# Altium project J2534 Adapter.PrjPcb
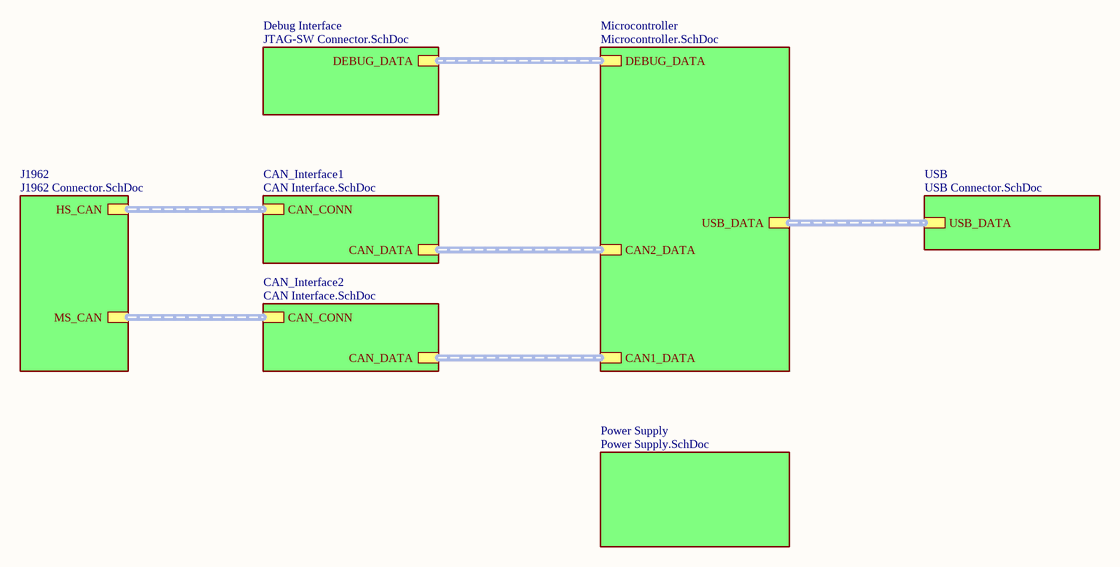
[diagram p0: Adapter_Func.SchDoc]
7 sheets, 55 parts. Net scope: hierarchical (ports join the sheet entries above them; power ports are global).
Board file: Main_Board.PcbDoc
Sheets:
  Adapter_Func.SchDoc
    Microcontroller = Microcontroller.SchDoc
    CAN_Interface1 = CAN Interface.SchDoc
    USB = USB Connector.SchDoc
    J1962 = J1962 Connector.SchDoc
    Power Supply = Power Supply.SchDoc
    Debug Interface = JTAG-SW Connector.SchDoc
    CAN_Interface2 = CAN Interface.SchDoc

## Sheet Adapter_Func.SchDoc
size A4; SheetNumber: 1; SheetTotal: 7

### Sub-sheets
CAN_Interface1 = CAN Interface.SchDoc: CAN_DATA (harness CAN_DATA), CAN_CONN (harness CAN_PHY)
CAN_Interface2 = CAN Interface.SchDoc: CAN_DATA (harness CAN_DATA), CAN_CONN (harness CAN_PHY)
Debug Interface = JTAG-SW Connector.SchDoc: DEBUG_DATA (harness JTAG_SWD)
J1962 = J1962 Connector.SchDoc: MS_CAN (harness CAN_PHY), HS_CAN (harness CAN_PHY)
Microcontroller = Microcontroller.SchDoc: DEBUG_DATA (harness JTAG_SWD), USB_DATA (harness USB_DATA), CAN2_DATA (harness CAN_DATA), CAN1_DATA (harness CAN_DATA)
Power Supply = Power Supply.SchDoc: no entries
USB = USB Connector.SchDoc: USB_DATA (harness USB_DATA)

### Buses and harness runs
harness sheet CAN_Interface1/CAN_CONN = sheet J1962/HS_CAN
harness sheet CAN_Interface1/CAN_DATA = sheet Microcontroller/CAN2_DATA
harness sheet CAN_Interface2/CAN_CONN = sheet J1962/MS_CAN
harness sheet CAN_Interface2/CAN_DATA = sheet Microcontroller/CAN1_DATA
harness sheet Debug Interface/DEBUG_DATA = sheet Microcontroller/DEBUG_DATA
harness sheet Microcontroller/USB_DATA = sheet USB/USB_DATA

## Sheet Microcontroller.SchDoc
size A4; SheetNumber: 7; SheetTotal: 7; SPICEModelCacheTAOBNIVI: <root> / <DocumentId>TAOBNIVI</DocumentId> / </root>
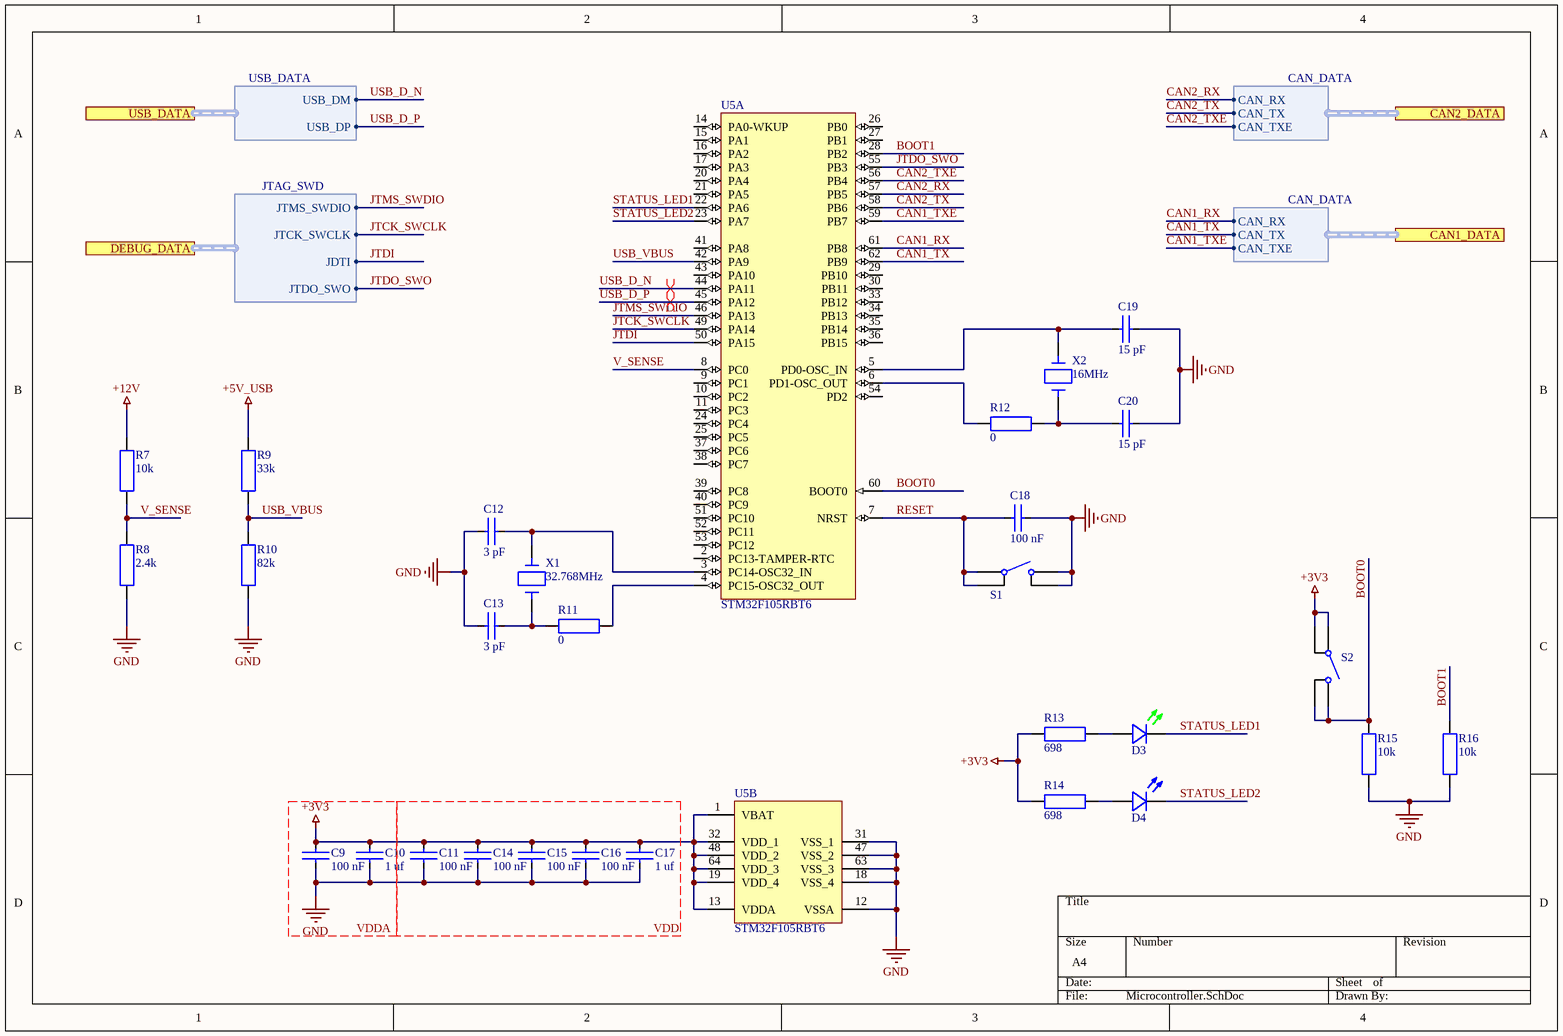
[diagram p1: Microcontroller.SchDoc]

### Parts
C9  100 nF  [0603 SMD CAP]
C10  1 uf  [0603 SMD CAP]
C11  100 nF  [0603 SMD CAP]
C12  3 pF  [0603 SMD CAP]
C13  3 pF  [0603 SMD CAP]
C14  100 nF  [0603 SMD CAP]
C15  100 nF  [0603 SMD CAP]
C16  100 nF  [0603 SMD CAP]
C17  1 uf  [0603 SMD CAP]
C18  100 nF  [0603 SMD CAP]
C19  15 pF  [0603 SMD CAP]
C20  15 pF  [0603 SMD CAP]
D3  LED Green 0603  [0603 SMD LED]  (value not drawn)
D4  LED Blue 0603  [0603 SMD LED]  (value not drawn)
R7  10k  [0603 SMD Res]
R8  2.4k  [0603 SMD Res]
R9  33k  [0603 SMD Res]
R10  82k  [0603 SMD Res]
R11  0  [0603 SMD Res]
R12  0  [0603 SMD Res]
R13  698  [0603 SMD Res]
R14  698  [0603 SMD Res]
R15  10k  [0603 SMD Res]
R16  10k  [0603 SMD Res]
S1  Tactile SPST Switch  [Tactile Switch 4.2x3.4]  (value not drawn)
S2  Tactile SPST Switch  [Tactile Switch 4.2x3.4]  (value not drawn)
U5  STM32F105RBT6  [STM-LQFP64_V]  (parts A,B of 2)
X1  32.768MHz  [3215 SMD CRYSTAL]
X2  16MHz  [3225 SMD Crystal]

### Ports
CAN1_DATA (harness CAN_DATA, see Adapter_Func[2B]), CAN2_DATA (harness CAN_DATA, see Adapter_Func[2B]), DEBUG_DATA (harness JTAG_SWD, see Adapter_Func[2A], JTAG-SW Connector[1B]), USB_DATA (harness USB_DATA, see Adapter_Func[3B], USB Connector[4B])

### Harnesses
CAN_DATA: CAN_RX, CAN_TX, CAN_TXE
USB_DATA: USB_DM, USB_DP
JTAG_SWD: JTMS_SWDIO, JTCK_SWCLK, JDTI, JTDO_SWO

### Nets
+3V3: C9.2 C10.2 C11.2 C14.2 C15.2 C16.2 C17.2 R13.2 R14.2 S2.1 S2.2 U5.1(VBAT) U5.13(VDDA) U5.19(VDD_4) U5.32(VDD_1) U5.48(VDD_2) U5.64(VDD_3)
+5V_USB: R9.2
+12V: R7.2
GND: C9.1 C10.1 C11.1 C12.1 C13.1 C14.1 C15.1 C16.1 C17.1 C18.2 C19.2 C20.2 R8.1 R10.1 R15.1 R16.1 S1.3 S1.4 U5.12(VSSA) U5.18(VSS_4) U5.31(VSS_1) U5.47(VSS_2) U5.63(VSS_3)
BOOT0: R15.2 S2.3 S2.4 U5.60(BOOT0)
BOOT1: R16.2 U5.28(PB2)
CAN1_RX: U5.61(PB8) ; port CAN1_DATA.CAN_RX
CAN1_TX: U5.62(PB9) ; port CAN1_DATA.CAN_TX
CAN1_TXE: U5.59(PB7) ; port CAN1_DATA.CAN_TXE
CAN2_RX: U5.57(PB5) ; port CAN2_DATA.CAN_RX
CAN2_TX: U5.58(PB6) ; port CAN2_DATA.CAN_TX
CAN2_TXE: U5.56(PB4) ; port CAN2_DATA.CAN_TXE
JTCK_SWCLK: U5.49(PA14) ; port DEBUG_DATA.JTCK_SWCLK
JTDI: U5.50(PA15) ; port DEBUG_DATA.JDTI
JTDO_SWO: U5.55(PB3) ; port DEBUG_DATA.JTDO_SWO
JTMS_SWDIO: U5.46(PA13) ; port DEBUG_DATA.JTMS_SWDIO
RESET: C18.1 S1.1 S1.2 U5.7(NRST)
STATUS_LED1: D3.2 U5.22(PA6)
STATUS_LED2: D4.2 U5.23(PA7)
USB_D_N: U5.44(PA11) ; port USB_DATA.USB_DM
USB_D_P: U5.45(PA12) ; port USB_DATA.USB_DP
USB_VBUS: R9.1 R10.2 U5.42(PA9)
V_SENSE: R7.1 R8.2 U5.8(PC0)
NetC12_2: C12.2 U5.3(PC14-OSC32_IN) X1.2
NetC13_2: C13.2 R11.2 X1.1
NetC19_1: C19.1 U5.5(PD0-OSC_IN) X2.3
NetC20_1: C20.1 R12.1 X2.1
NetD3_1: D3.1 R13.1
NetD4_1: D4.1 R14.1
NetR11_1: R11.1 U5.4(PC15-OSC32_OUT)
NetR12_2: R12.2 U5.6(PD1-OSC_OUT)

Not connected (* = marked no-connect by the designer): U5 2(PC13-TAMPER-RTC) 9(PC1) 10(PC2) 11(PC3) 14(PA0-WKUP) 15(PA1) 16(PA2) 17(PA3) 20(PA4) 21(PA5) 24(PC4) 25(PC5) 26(PB0) 27(PB1) 29(PB10) 30(PB11) 33(PB12) 34(PB13) 35(PB14) 36(PB15) 37(PC6) 38(PC7) 39(PC8) 40(PC9) 41(PA8) 43(PA10) 51(PC10) 52(PC11) 53(PC12) 54(PD2)

### Layout directives
differential pair: USB_D_N, USB_D_P

### Notes on the sheet
- VDDA
- VDD

### Library data of the parts
C9 C11 C14-C16 C18 = Cap 100nF 0603: 25V 100nF X7R ±10% 0603 Multilayer Ceramic Capacitors MLCC; Part Number: CL10B104KA8NNNC; ComponentLink1Description: LCSC; ComponentLink1URL: https://lcsc.com/product-detail/Multilayer-Ceramic-Capacitors-MLCC-SMD-SMT_Samsung-Electro-Mechanics-CL10B104KA8NNNC_C1590.html
C10 C17 = Cap 1u 0603: 25V 1uF X5R ±10% 0603 Multilayer Ceramic Capacitors MLCC; Part Number: CC0603KRX5R8BB105
C12 C13 = Cap 3pF 0603: 50V 3pF NP0 0.25pF 0603 Multilayer Ceramic Capacitors MLCC; Part Number: CC0603JRNPO9BN100
C19 C20 = Cap 15pF 0603: 50V 15pF NP0 ±5% 0603 Multilayer Ceramic Capacitors MLCC; Part Number: CC0603JRNPO9BN100
D3 = LED Green 0603: 20mA 518nm Colorless transparence -40℃~+85℃ 520nm~535nm Emerald 120° 110mW 0603; Part Number: 19-217/GHC-YR1S2/3T; ComponentLink1Description: Datasheet; ComponentLink1URL: https://datasheet.lcsc.com/lcsc/1811101510_Everlight-Elec-19-217-GHC-YR1S2-3T_C72043.pdf
D4 = LED Blue 0603: 25mA Green -30℃~+85℃ Positive post Blue 120° 80mW 0603; Part Number: XL-1608BGWC-06; ComponentLink1Description: Datasheet; ComponentLink1URL: https://datasheet.lcsc.com/lcsc/2211030000_XINGLIGHT-XL-1608BGWC-06_C965809.pdf
R7 R15 R16 = Resistor 10k 0603 1%: Part Number: RC0603FR-0710KL
R8 = Resistor 2.4k 0603 1%: 100mW Thick Film Resistors 75V ±100ppm/℃ ±1% -55℃~+155℃ 2.4kΩ 0603 Chip Resistor; Part Number: RC0603FR-072K4L
R9 = Resistor 33k 0603: 100mW Thin Film Resistor 75V ±25ppm/℃ ±1% -55℃~+155℃ 33kΩ 0603 Chip Resistor; Part Number: ARG03FTC3302; ComponentLink1Description: LCSC; ComponentLink1URL: https://lcsc.com/product-detail/Chip-Resistor-Surface-Mount_Viking-Tech-ARG03FTC3302_C217971.html
R10 = Resistor 82k 0603: 100mW Thick Film Resistors 50V ±100ppm/℃ ±1% -55℃~+155℃ 82kΩ 0603 Chip Resistor; Part Number: FRC0603F8202TS; ComponentLink1Description: LCSC; ComponentLink1URL: https://lcsc.com/product-detail/Chip-Resistor-Surface-Mount_FOJAN-FRC0603F8202TS_C2907072.html
R11 R12 = Resistor 0 0603: Thick Film Resistors -55℃~+155℃ 0Ω 0603 Chip Resistor; Part Number: FRC0603P000 TS; ComponentLink1Description: LCSC; ComponentLink1URL: https://lcsc.com/product-detail/Chip-Resistor-Surface-Mount_FOJAN-FRC0603P000-TS_C2907080.html
R13 R14 = Resistor 698 0603 1%: 100mW Thick Film Resistors 75V ±100ppm/℃ ±1% -55℃~+155℃ 698Ω 0603 Chip Resistor; Part Number: AC0603FR-07698RL; ComponentLink1Description: LCSC; ComponentLink1URL: https://lcsc.com/product-detail/Chip-Resistor-Surface-Mount_YAGEO-AC0603FR-07698RL_C144640.html
S1 S2 = Tactile SPST Switch: Part Number: YTSA016C0254004B; ComponentLink1Description: Datasheet; ComponentLink1URL: https://datasheet.lcsc.com/lcsc/2106061735_DGBZ-YTSA016C0254004B_C2764970.pdf
U5 = CMP-0237-00224-3: ARM Cortex-M3 32-bit MCU, 128 KB Flash, 64 KB Internal RAM, 51 I/Os, 64-pin LQFP, -40 to 85 degC, Tray; D/A Converter: 2x12-bit (2 Channel); Supply Voltage(Vcc) min (V): 2; A/D Converter: 2x12-bit (16 Channel); Internal RAM Size (kB): 64; Operating Frequency(F) (Processor speed) (MHz): 72; FLASH Size (Prog) (kB): 128; I/Os (High Current): 51; ComponentLink2Description: Datasheet; Core: ARM Cortex-M3; ComponentLink2URL: http://www.st.com/st-web-ui/static/active/en/resource/technical/document/datasheet/CD00220364.pdf; Mounting Technology: Surface Mount; PackageVersion: Rev. 4, 06/2013; PackageReference: LQFP64; PartNumber: STM32F105RBT6; ComponentLink3URL: http://www.st.com/st-web-ui/static/active/en/resource/technical/document/datasheet/DM00037051.pdf; DatasheetVersion: Rev. 6; PackageDescription: 64-Pin Low Profile Quad Flat Package, 10 x 10 mm Body, 0.5 mm Pitch; ComponentLink3Description: Package Specification; ComponentLink1Description: Manufacturer URL; ComponentLink1URL: http://www.st.com/web/en/home.html; Packing: Tray
X1 = Crystal 32.768MHz SMD: 32.768kHz 6pF 70kΩ ±20ppm -40℃~+85℃ SMD3215-2P Crystals ROHS; Part Number: NX3215SA-32.768K-STD-MUA-14; ComponentLink1Description: Datasheet; ComponentLink1URL: https://datasheet.lcsc.com/lcsc/1810171130_NDK-NX3215SA-32-768K-STD-MUA-14_C156244.pdf
X2 = Crystal 16MHz 3225: Crystal 16MHz 12pf; ComponentLink1Description: ChipDip; ComponentLink1URL: https://www.chipdip.ru/product0/8010531849

## Sheet CAN Interface.SchDoc
size A4; SheetNumber: 4; SheetTotal: 7
Used 2 times, as channels CAN_Interface1, CAN_Interface2. Parts and nets are listed once, with the designators drawn on the sheet.
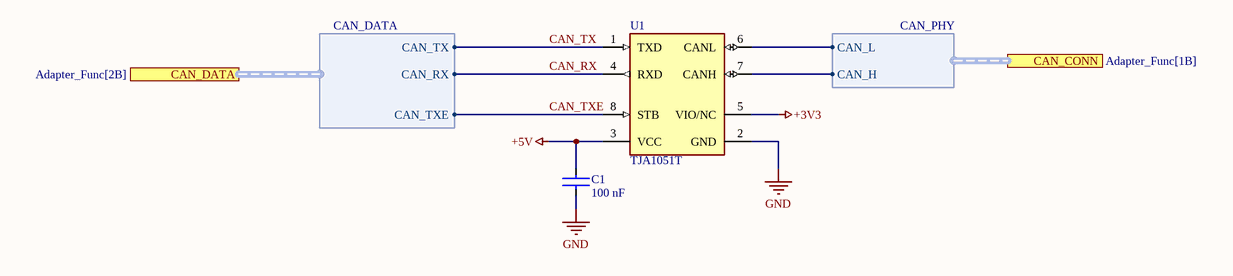
[diagram p2: CAN Interface.SchDoc]

### Parts
C1  100 nF  [0603 SMD CAP]
U1  TJA1051T  [SOIC-8]

### Ports
CAN_CONN (harness CAN_PHY, see Adapter_Func[1B]), CAN_DATA (harness CAN_DATA, see Adapter_Func[2B])

### Harnesses
CAN_DATA: CAN_TX, CAN_RX, CAN_TXE
CAN_PHY: CAN_L, CAN_H

### Nets
+3V3: U1.5(VIO/NC)
+5V: C1.2 U1.3(VCC)
GND: C1.1 U1.2(GND)
CAN_RX: U1.4(RXD) ; port CAN_DATA.CAN_RX
CAN_TX: U1.1(TXD) ; port CAN_DATA.CAN_TX
CAN_TXE: U1.8(STB) ; port CAN_DATA.CAN_TXE
NetU1_6: U1.6(CANL) ; port CAN_CONN.CAN_L
NetU1_7: U1.7(CANH) ; port CAN_CONN.CAN_H

### Channels
CAN_Interface1: designators end in A
CAN_Interface2: designators end in B

### Library data of the parts
C1 = Cap 100nF 0603: as C9 on sheet Microcontroller; ComponentLink1Description: LCSC; ComponentLink1URL: https://lcsc.com/product-detail/Multilayer-Ceramic-Capacitors-MLCC-SMD-SMT_Samsung-Electro-Mechanics-CL10B104KA8NNNC_C1590.html
U1 = CAN Transeiver TJA1051T: TJA1051T CAN Transeiver up to 5 Mbaud/s; Part Number: TJA1051T,118; ComponentLink1Description: Datasheet; ComponentLink1URL: https://datasheet.lcsc.com/lcsc/1809192316_NXP-Semicon-TJA1051T-118_C18387.pdf

## Sheet USB Connector.SchDoc
size A4; SheetNumber: 5; SheetTotal: 7
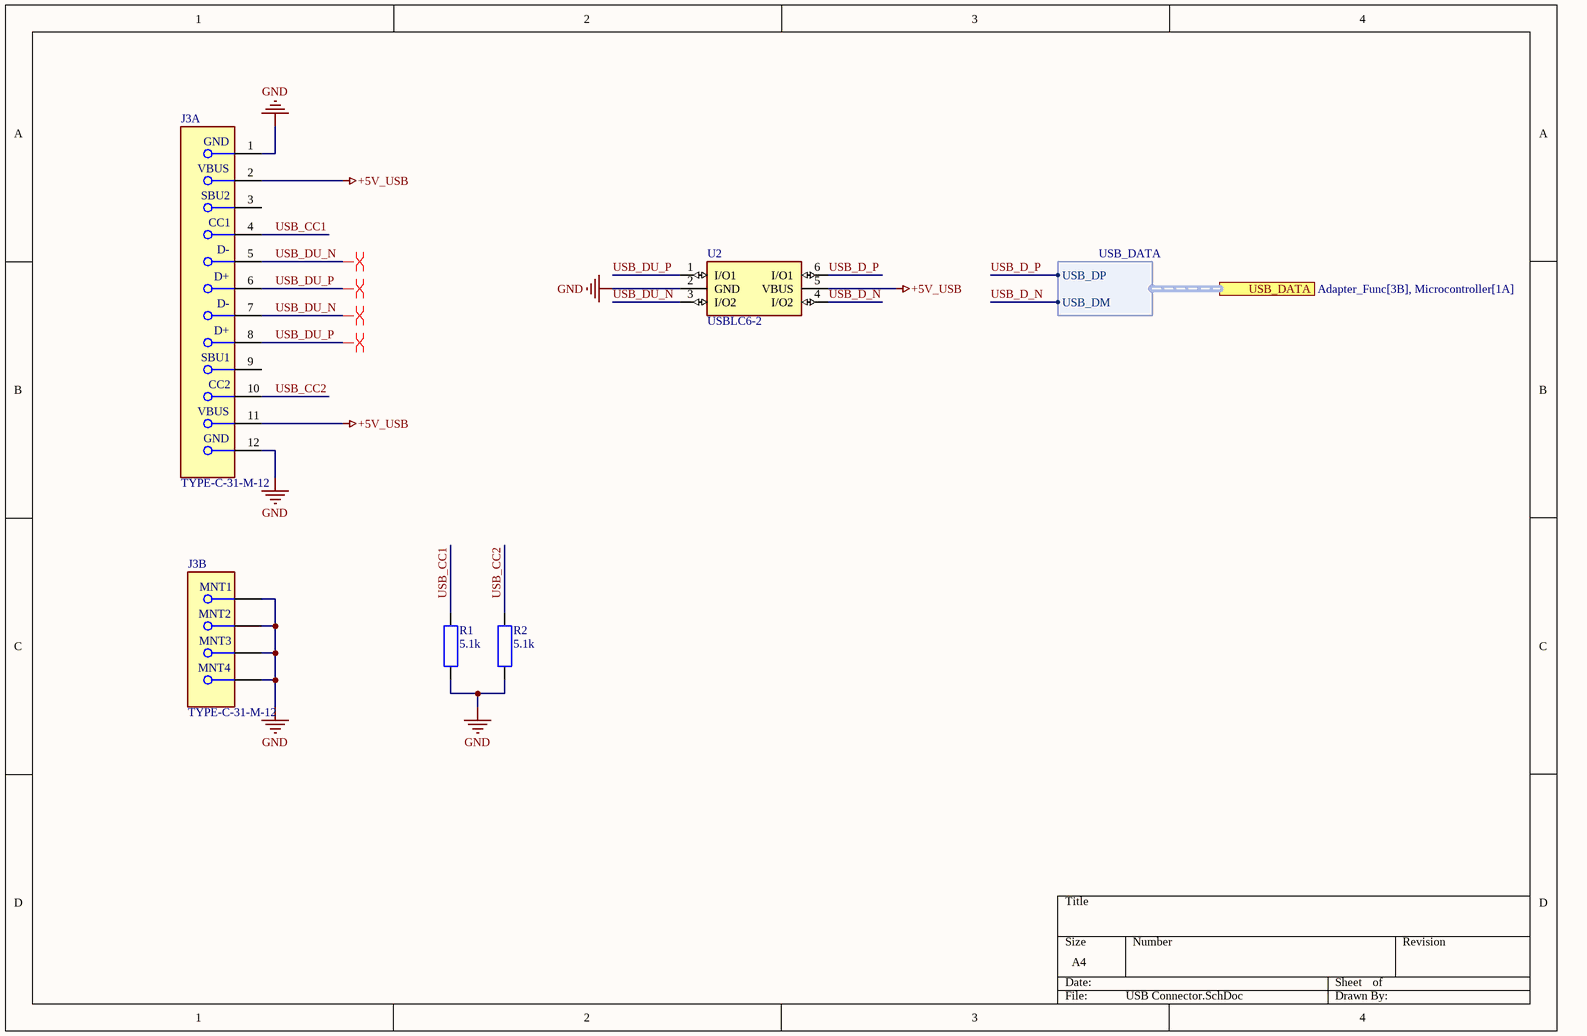
[diagram p3: USB Connector.SchDoc]

### Parts
J3  TYPE-C-31-M-12  [TYPE-C-31-M-12]  (parts A,B of 2)
R1  5.1k  [0603 SMD Res]
R2  5.1k  [0603 SMD Res]
U2  USBLC6-2  [SOT23-6L]

### Ports
USB_DATA (harness USB_DATA, see Adapter_Func[3B], Microcontroller[1A])

### Harnesses
USB_DATA: USB_DP, USB_DM

### Nets
+5V_USB: J3.2 J3.11 U2.5(VBUS)
GND: J3.1 J3.12 J3.13 J3.14 J3.15 J3.16 R1.1 R2.1 U2.2(GND)
USB_CC1: J3.4 R1.2
USB_CC2: J3.10 R2.2
USB_D_N: U2.4(I/O2) ; port USB_DATA.USB_DM
USB_D_P: U2.6(I/O1) ; port USB_DATA.USB_DP
USB_DU_N: J3.5 J3.7 U2.3(I/O2)
USB_DU_P: J3.6 J3.8 U2.1(I/O1)

Not connected (* = marked no-connect by the designer): J3 3 9

### Layout directives
differential pair: USB_DU_N, USB_DU_P

### Notes on the sheet
- (in symbol USB-C Receptable Top Mount TYPE-C-31-M-12, part A) GND; VBUS; SBU2; CC1; D-; D+; SBU1; CC2
- (in symbol USB-C Receptable Top Mount TYPE-C-31-M-12, part B) MNT1; MNT2; MNT3; MNT4

### Library data of the parts
J3 = USB-C Receptable Top Mount TYPE-C-31-M-12: 5A 1 16 Female Type-C SMD USB Connectors ROHS; ComponentLink1Description: Datasheet; ComponentLink1URL: https://datasheet.lcsc.com/lcsc/2205251630_Korean-Hroparts-Elec-TYPE-C-31-M-12_C165948.pdf; Pin Count: 12; Part Number: TYPE-C-31-M-12
R1 R2 = Resistor 5.1k 0603 1%: Part Number: RC0603FR-075K1L; ComponentLink1Description: ChipDip; ComponentLink1URL: https://www.chipdip.ru/product/0.1w-0603-5.1-kom-1
U2 = USB ESD Protection IC USBLC6-2: Part Number: USBLC6-2SC6

## Sheet J1962 Connector.SchDoc
size A4; SheetNumber: 3; SheetTotal: 7
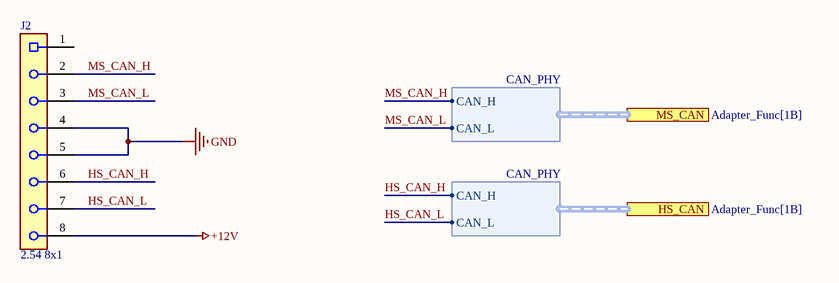
[diagram p4: J1962 Connector.SchDoc]

### Parts
J2  2.54 8x1  [PLS-8X1]

### Ports
HS_CAN (harness CAN_PHY, see Adapter_Func[1B]), MS_CAN (harness CAN_PHY, see Adapter_Func[1B])

### Harnesses
CAN_PHY: CAN_H, CAN_L

### Nets
+12V: J2.8
GND: J2.4 J2.5
HS_CAN_H: J2.6 ; port HS_CAN.CAN_H
HS_CAN_L: J2.7 ; port HS_CAN.CAN_L
MS_CAN_H: J2.2 ; port MS_CAN.CAN_H
MS_CAN_L: J2.3 ; port MS_CAN.CAN_L

Not connected (* = marked no-connect by the designer): J2 1

### Library data of the parts
J2 = 2.54mm 8x1

## Sheet Power Supply.SchDoc
size A4; SheetNumber: 6; SheetTotal: 7
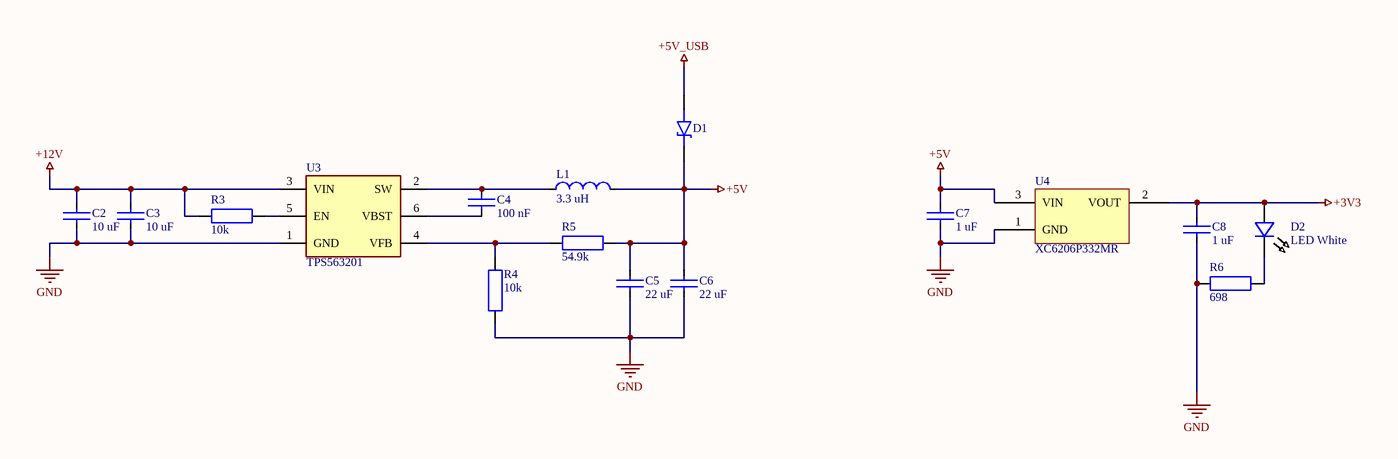
[diagram p5: Power Supply.SchDoc]

### Parts
C2  10 uF  [0603 SMD CAP]
C3  10 uF  [0603 SMD CAP]
C4  100 nF  [0603 SMD CAP]
C5  22 uF  [0805 SMD Cap]
C6  22 uF  [0805 SMD Cap]
C7  1 uF  [0603 SMD CAP]
C8  1 uF  [0603 SMD CAP]
D1  Diode Shottky SOD-323  [SOD-323]  (value not drawn)
D2  LED White  [0603 SMD LED]
L1  3.3 uH  [1210 Inductor SMD]
R3  10k  [0603 SMD Res]
R4  10k  [0603 SMD Res]
R5  54.9k  [0603 SMD Res]
R6  698  [0603 SMD Res]
U3  TPS563201  [SOT23-6L]
U4  XC6206P332MR  [SOT23-3]

### Nets
+3V3: C8.2 D2.1 U4.2(VOUT)
+5V: C5.2 C6.2 C7.2 D1.2 L1.2 R5.1 U4.3(VIN)
+5V_USB: D1.1
+12V: C2.2 C3.2 R3.2 U3.3(VIN)
GND: C2.1 C3.1 C5.1 C6.1 C7.1 C8.1 R4.1 R6.2 U3.1(GND) U4.1(GND)
NetC4_1: C4.1 U3.6(VBST)
NetC4_2: C4.2 L1.1 U3.2(SW)
NetD2_2: D2.2 R6.1
NetR3_1: R3.1 U3.5(EN)
NetR4_2: R4.2 R5.2 U3.4(VFB)

### Library data of the parts
C2 C3 = Cap 10uf 0603: 25V 10uF X5R ±20% 0603 Multilayer Ceramic Capacitors; Part Number: CL10A106MA8NRNC
C4 = Cap 100nF 0603: as C9 on sheet Microcontroller; ComponentLink1Description: LCSC; ComponentLink1URL: https://lcsc.com/product-detail/Multilayer-Ceramic-Capacitors-MLCC-SMD-SMT_Samsung-Electro-Mechanics-CL10B104KA8NNNC_C1590.html
C5 C6 = Cap 22uF 0805: 25V 22uF X5R ±20% 0805 Multilayer Ceramic Capacitors; Part Number: CL21A226MAYNNNE
C7 C8 = Cap 1u 0603: as C10 on sheet Microcontroller
D1 = Diode Shottky SOD-323: 20V 450mV@1A 1A SOD-323 Schottky Barrier Diodes; Part Number: B5817WS; ComponentLink1Description: LCSC; ComponentLink1URL: https://lcsc.com/product-detail/Schottky-Barrier-Diodes-SBD_Shandong-Jingdao-Microelectronics-B5817WS_C123899.html
D2 = LED White 0603: 5mA Yellow -40℃~+85℃ White light 120° 100mW 0603 Light Emitting Diodes (LED) ROHS; Part Number: SZYY0603W; ComponentLink1Description: Datasheet; ComponentLink1URL: https://datasheet.lcsc.com/lcsc/1912111437_Yongyu-Photoelectric-SZYY0603W_C434422.pdf
L1 = Ind 3.3mH 1210: 1.55A 3.3uH ±30% 1.9A 100mΩ 1210 Inductors (SMD) ROHS; Part Number: LQH32PN3R3NNCL; ComponentLink1Description: Datasheet; ComponentLink1URL: https://datasheet.lcsc.com/lcsc/2108040830_Murata-Electronics-LQH32PN3R3NNCL_C2044639.pdf
R3 R4 = Resistor 10k 0603 1%: Part Number: RC0603FR-0710KL
R5 = Resistor 54.9k 0603 1%: 100mW Thick Film Resistors 75V ±100ppm/℃ ±1% -55℃~+155℃ 54.9kΩ 0603; Part Number: RC0603FR-0754K9L; ComponentLink1Description: LCSC; ComponentLink1URL: https://lcsc.com/product-detail/Chip-Resistor-Surface-Mount_YAGEO-RC0603FR-0754K9L_C185321.html
R6 = Resistor 698 0603 1%: as R13 on sheet Microcontroller; ComponentLink1Description: LCSC; ComponentLink1URL: https://lcsc.com/product-detail/Chip-Resistor-Surface-Mount_YAGEO-AC0603FR-07698RL_C144640.html
U3 = DC-DC Buck Converter TPS563201: Step-down type -40℃~+125℃@(TJ) 1 Step-down Adjustable 0.768V~7V 3A 4.5V~17V 580kHz SOT-23-THIN-6; Part Number: TPS563201DDCR; ComponentLink1Description: Datasheet; ComponentLink1URL: https://www.ti.com/lit/ds/symlink/tps563201.pdf?ts=1668072977388
U4 = LDO 3V3 SOT-23-3: 40dB@(1kHz) 100mA 240mV@(50mA) Fixed 3.3V~3.3V Positive 1 8V SOT-23 Linear Voltage Regulators; Part Number: XC6206P332MR; ComponentLink1Description: Datasheet; ComponentLink1URL: https://static.chipdip.ru/lib/848/DOC018848972.pdf

## Sheet JTAG-SW Connector.SchDoc
size A4; SheetNumber: 2; SheetTotal: 7
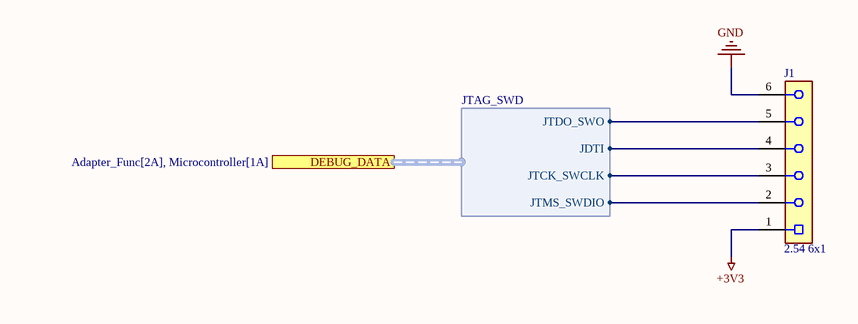
[diagram p6: JTAG-SW Connector.SchDoc]

### Parts
J1  2.54 6x1  [PLS-6x1]

### Ports
DEBUG_DATA (harness JTAG_SWD, see Adapter_Func[2A], Microcontroller[1A])

### Harnesses
JTAG_SWD: JDTI, JTDO_SWO, JTMS_SWDIO, JTCK_SWCLK

### Nets
+3V3: J1.1
GND: J1.6
JTCK_SWCLK: J1.3 ; port DEBUG_DATA.JTCK_SWCLK
JTDI: J1.4 ; port DEBUG_DATA.JDTI
JTDO_SWO: J1.5 ; port DEBUG_DATA.JTDO_SWO
JTMS_SWDIO: J1.2 ; port DEBUG_DATA.JTMS_SWDIO

### Library data of the parts
J1 = 2.54mm 6x1

## Nets that join several sheets
+3V3: Microcontroller (17 pins), CAN_Interface1 (U1A.5), Power Supply (C8.2 D2.1 U4.2), JTAG-SW Connector (J1.1), CAN_Interface2 (U1B.5)
+5V: CAN_Interface1 (C1A.2 U1A.3), Power Supply (7 pins), CAN_Interface2 (C1B.2 U1B.3)
+5V_USB: Microcontroller (R9.2), USB Connector (J3.2 J3.11 U2.5), Power Supply (D1.1)
+12V: Microcontroller (R7.2), J1962 Connector (J2.8), Power Supply (C2.2 C3.2 R3.2 U3.3)
GND: Microcontroller (23 pins), CAN_Interface1 (C1A.1 U1A.2), USB Connector (9 pins), J1962 Connector (J2.4 J2.5), Power Supply (10 pins), JTAG-SW Connector (J1.6), CAN_Interface2 (C1B.1 U1B.2)
CAN1_RX: Microcontroller (U5.61), CAN_Interface2 (U1B.4)
CAN1_TX: Microcontroller (U5.62), CAN_Interface2 (U1B.1)
CAN1_TXE: Microcontroller (U5.59), CAN_Interface2 (U1B.8)
CAN2_RX: Microcontroller (U5.57), CAN_Interface1 (U1A.4)
CAN2_TX: Microcontroller (U5.58), CAN_Interface1 (U1A.1)
CAN2_TXE: Microcontroller (U5.56), CAN_Interface1 (U1A.8)
HS_CAN_H: CAN_Interface1 (U1A.7), J1962 Connector (J2.6)
HS_CAN_L: CAN_Interface1 (U1A.6), J1962 Connector (J2.7)
JTCK_SWCLK: Microcontroller (U5.49), JTAG-SW Connector (J1.3)
JTDI: Microcontroller (U5.50), JTAG-SW Connector (J1.4)
JTDO_SWO: Microcontroller (U5.55), JTAG-SW Connector (J1.5)
JTMS_SWDIO: Microcontroller (U5.46), JTAG-SW Connector (J1.2)
MS_CAN_H: J1962 Connector (J2.2), CAN_Interface2 (U1B.7)
MS_CAN_L: J1962 Connector (J2.3), CAN_Interface2 (U1B.6)
USB_D_N: Microcontroller (U5.44), USB Connector (U2.4)
USB_D_P: Microcontroller (U5.45), USB Connector (U2.6)